# Altium schematic sheet potmeters.SchDoc
size A4; SheetNumber: 2; SheetTotal: 4
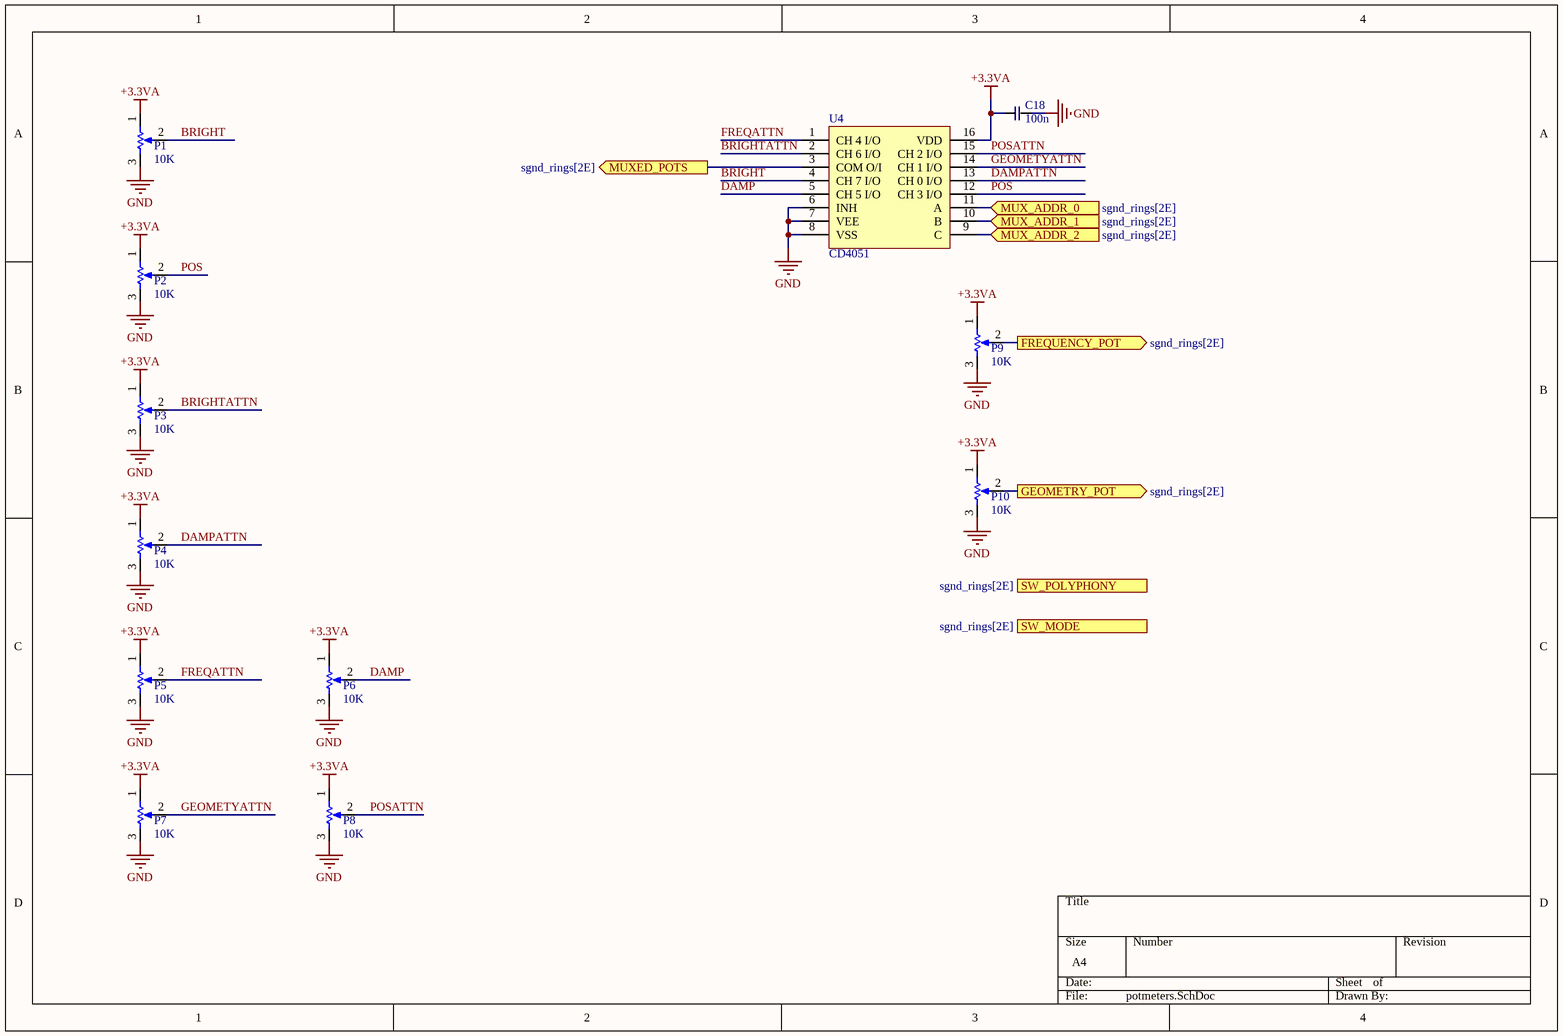
[diagram p0: potmeters.SchDoc]

## Parts
C18  value 100n  [C0603]  (hidden comment: Capacitor)
P1  value 10K  [Potentiometer_vertical]  (hidden comment: BRIGHT)
P2  value 10K  [Potentiometer_vertical]  (hidden comment: BRIGHT)
P3  value 10K  [Potentiometer_vertical]  (hidden comment: BRIGHT)
P4  value 10K  [Potentiometer_vertical]  (hidden comment: BRIGHT)
P5  value 10K  [Potentiometer_vertical]  (hidden comment: BRIGHT)
P6  value 10K  [Potentiometer_vertical]  (hidden comment: BRIGHT)
P7  value 10K  [Potentiometer_vertical]  (hidden comment: BRIGHT)
P8  value 10K  [Potentiometer_vertical]  (hidden comment: BRIGHT)
P9  value 10K  [Potentiometer_vertical]  (hidden comment: BRIGHT)
P10  value 10K  [Potentiometer_vertical]  (hidden comment: BRIGHT)
U4  CD4051  [SOP16]

## Ports
FREQUENCY_POT (out, see sgnd_rings[2E]), GEOMETRY_POT (out, see sgnd_rings[2E]), MUX_ADDR_0 (in, see sgnd_rings[2E]), MUX_ADDR_1 (in, see sgnd_rings[2E]), MUX_ADDR_2 (in, see sgnd_rings[2E]), MUXED_POTS (out, see sgnd_rings[2E]), SW_MODE (out, see sgnd_rings[2E]), SW_POLYPHONY (out, see sgnd_rings[2E])

## Nets
+3.3VA: C18.1 P1.1(BOT) P2.1(BOT) P3.1(BOT) P4.1(BOT) P5.1(BOT) P6.1(BOT) P7.1(BOT) P8.1(BOT) P9.1(BOT) P10.1(BOT) U4.16(VDD)
GND: C18.2 P1.3(TOP) P2.3(TOP) P3.3(TOP) P4.3(TOP) P5.3(TOP) P6.3(TOP) P7.3(TOP) P8.3(TOP) P9.3(TOP) P10.3(TOP) U4.6(INH) U4.7(VEE) U4.8(VSS)
BRIGHT: P1.2(TAP) U4.4(CH_7_I/O)
BRIGHTATTN: P3.2(TAP) U4.2(CH_6_I/O)
DAMP: P6.2(TAP) U4.5(CH_5_I/O)
DAMPATTN: P4.2(TAP) U4.13(CH_0_I/O)
FREQATTN: P5.2(TAP) U4.1(CH_4_I/O)
FREQUENCY_POT: P9.2(TAP) ; port FREQUENCY_POT
GEOMETRY_POT: P10.2(TAP) ; port GEOMETRY_POT
GEOMETYATTN: P7.2(TAP) U4.14(CH_1_I/O)
MUX_ADDR_0: U4.11(A) ; port MUX_ADDR_0
MUX_ADDR_1: U4.10(B) ; port MUX_ADDR_1
MUX_ADDR_2: U4.9(C) ; port MUX_ADDR_2
MUXED_POTS: U4.3(COM_O/I) ; port MUXED_POTS
POS: P2.2(TAP) U4.12(CH_3_I/O)
POSATTN: P8.2(TAP) U4.15(CH_2_I/O)

## Library data of the parts
C18 = Capacitor: Capacitor (Semiconductor SIM Model); Published: 8-Jun-2000; LatestRevisionDate: 29-May-2009; LatestRevisionNote: IPC-7351 Footprint Added.; PackageReference: C1206; Publisher: Altium Limited; PackageDescription: Chip Capacitor
P1-P10 = RPot: Potentiometer; Sim Note: Enter the Resistance value and the set point into parameter fields.; Set Position: 0.5; Published: 8-Jun-2000; LatestRevisionDate: 17-Jul-2002; LatestRevisionNote: Re-released for DXP Platform.; PackageReference: VR5; Publisher: Altium Limited; PackageDescription: Variable Resistor, Thru-Hole; 3 Leads
U4 = CD4051: CD4051 CMOS Single 8-Channel Analog Multiplexer/Demultiplexer  With Logic-Level Conversion; Value: CD4051